# EAGLE schematic cluster (EAGLE 9.6.2)
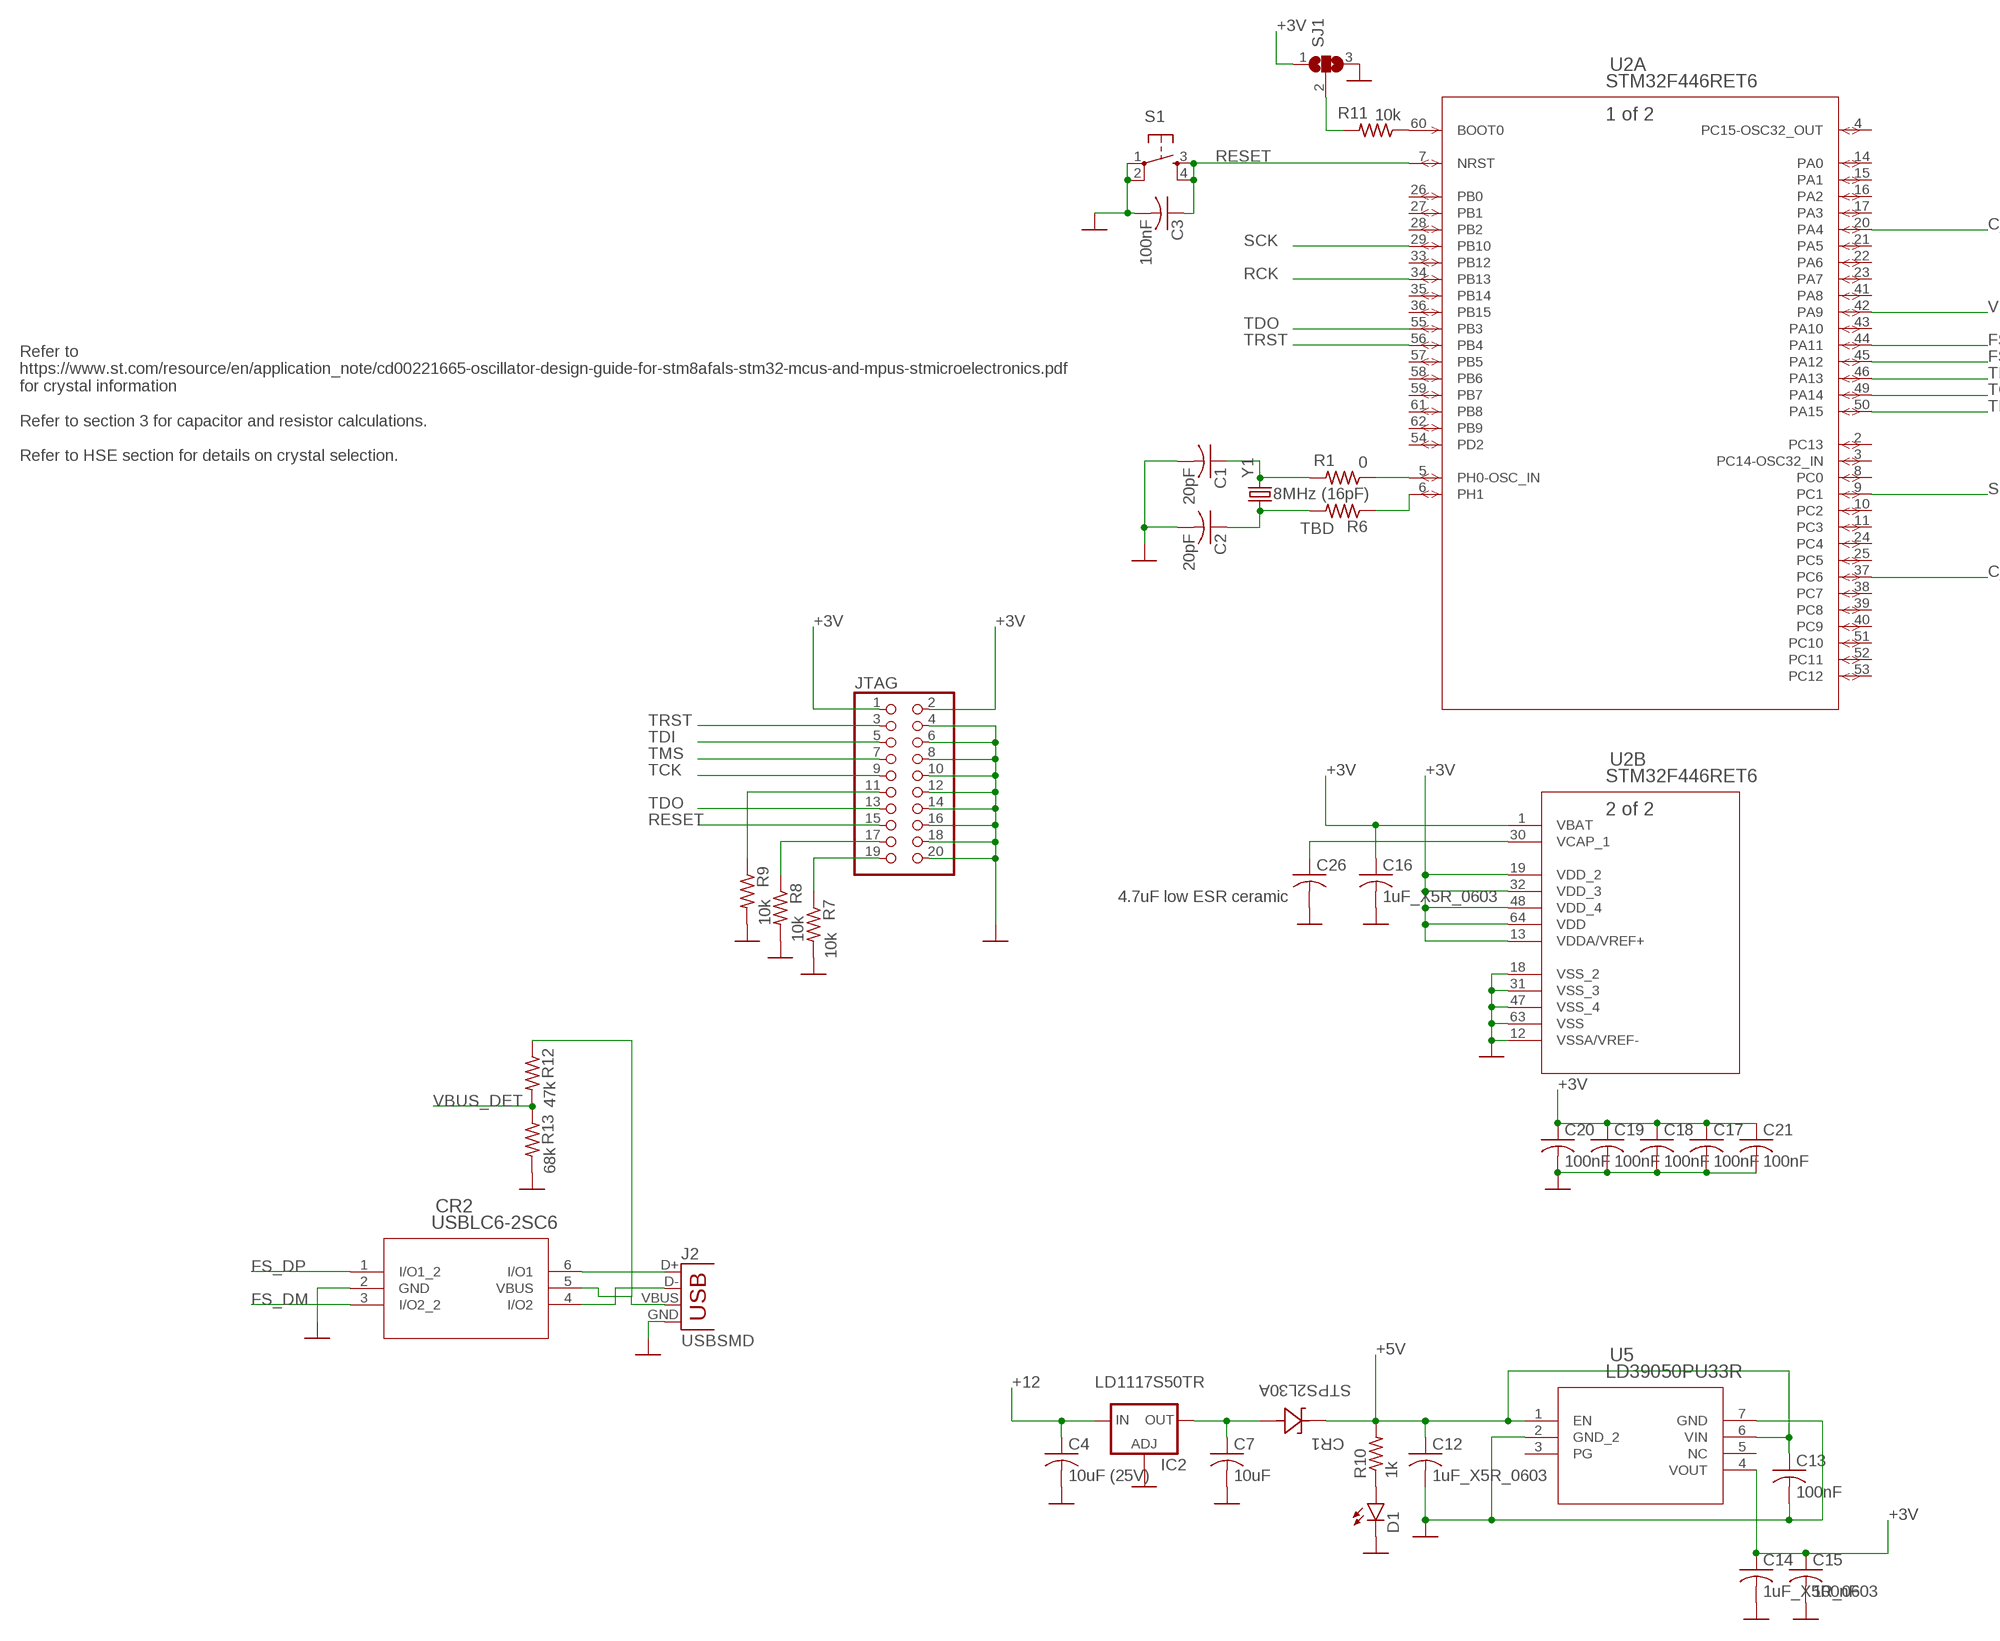
[diagram p0: schematic, sheet 1, part 1 of 2]
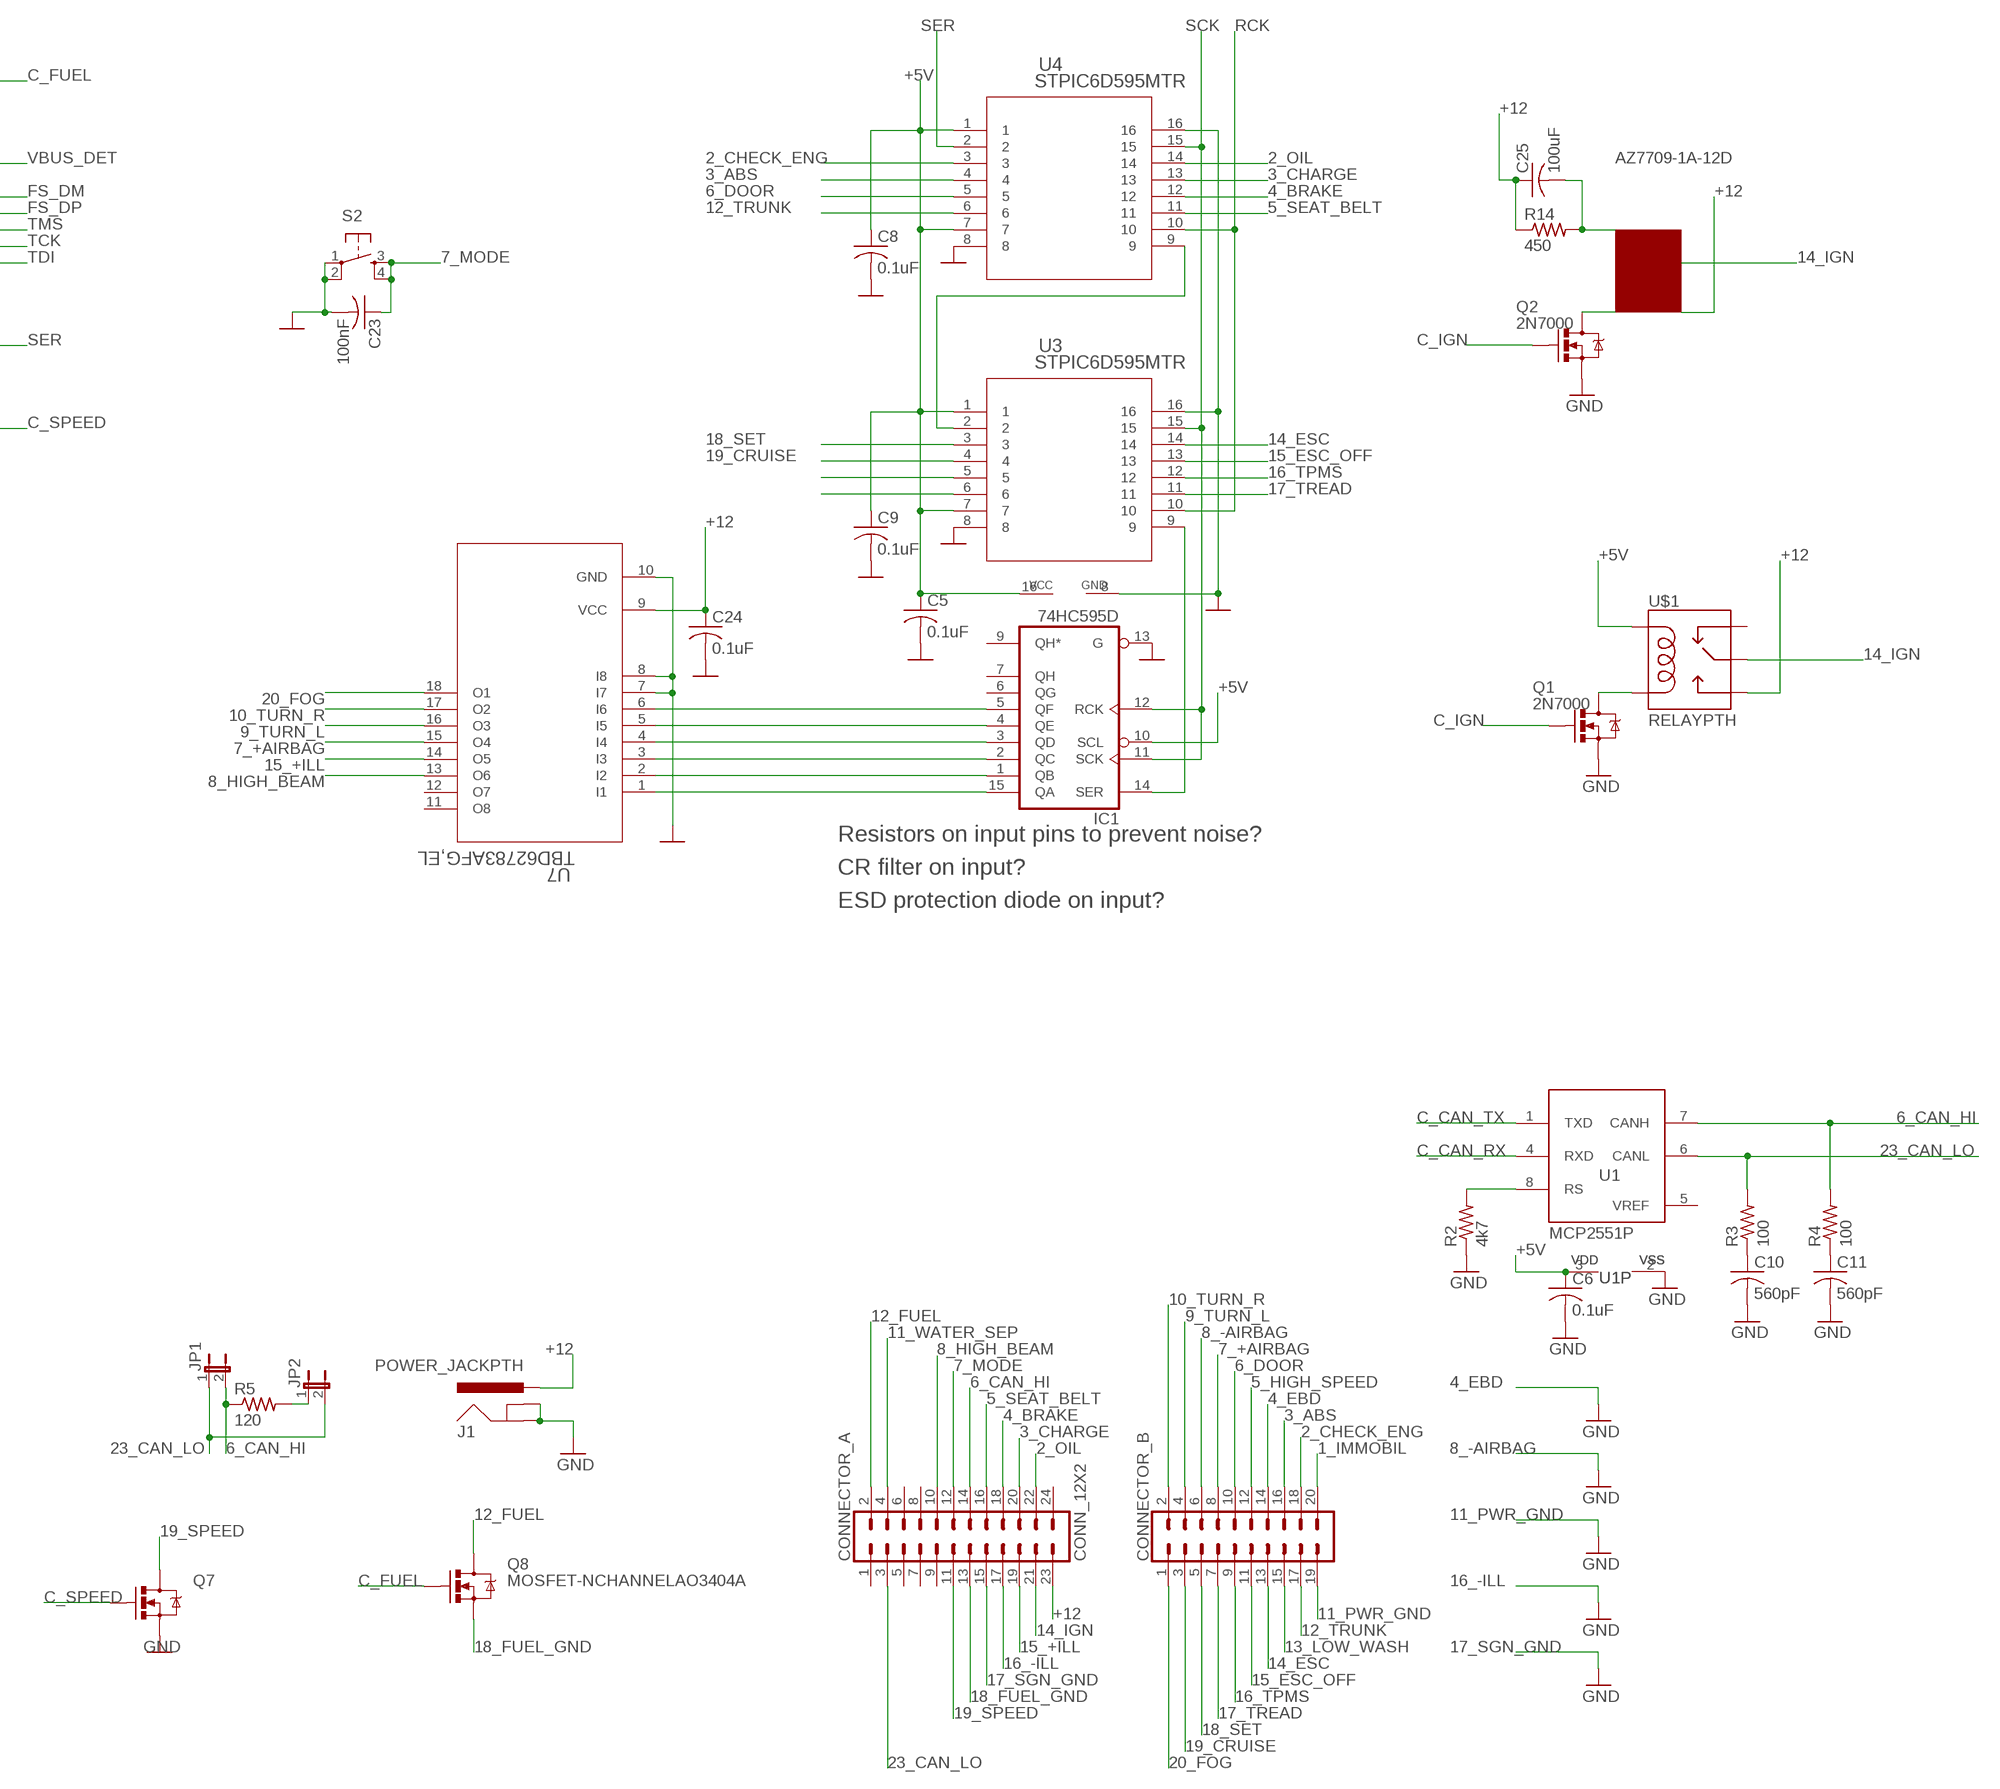
[diagram p1: schematic, sheet 1, part 2 of 2]

## Parts
C1  20pF  C-USC0805K  [C0805K]
C2  20pF  C-USC0805K  [C0805K]
C3  100nF  C-USC0805K  [C0805K]
C4  10uF (25V)  C-USC0805K  [C0805K]
C5  0.1uF  C-USC0805K  [C0805K]
C6  0.1uF  C-USC0805K  [C0805K]
C7  10uF  C-USC0805K  [C0805K]
C8  0.1uF  C-USC0805K  [C0805K]
C9  0.1uF  C-USC0805K  [C0805K]
C10  560pF  C-USC0805K  [C0805K]
C11  560pF  C-USC0805K  [C0805K]
C12  1uF_X5R_0603  C-USC0805K  [C0805K]
C13  100nF  C-USC0805K  [C0805K]
C14  1uF_X5R_0603  C-USC0805K  [C0805K]
C15  100nF  C-USC0805K  [C0805K]
C16  1uF_X5R_0603  C-USC0805K  [C0805K]
C17  100nF  C-USC0805K  [C0805K]
C18  100nF  C-USC0805K  [C0805K]
C19  100nF  C-USC0805K  [C0805K]
C20  100nF  C-USC0805K  [C0805K]
C21  100nF  C-USC0805K  [C0805K]
C23  100nF  C-USC0805K  [C0805K]
C24  0.1uF  C-USC0805K  [C0805K]
C25  100uF  C-USC0805K  [C0805K]
C26  4.7uF low ESR ceramic  C-USC1206K  [C1206K]
CONNECTOR_A  CONN_12X2  [2X12]
CONNECTOR_B  CONN_10X2NOSILK  [2X10_NOSILK]
CR1  STPS2L30A  [SMA_STM]
CR2  USBLC6-2SC6  [SOT23-6L_STM]
D1  LED-FKIT-1206  [FKIT-LED-1206]
IC1  74HC595D  [SO16]
IC2  LD117AS12TR  [SOT223]
J1  POWER_JACKPTH  [POWER_JACK_PTH]
J2  USBSMD  [USB-MINIB]
JP1  JP1E  [JP1]
JP2  JP1E  [JP1]
JTAG  PINHD-2X10  [2X10]
Q1  2N7000  MOSFET-NCHANNELAO3404A  [SOT23-3]
Q2  2N7000  MOSFET-NCHANNELAO3404A  [SOT23-3]
Q7  MOSFET-NCHANNELAO3404A  [SOT23-3]
Q8  MOSFET-NCHANNELAO3404A  [SOT23-3]
R1  0  R-US_R0805  [R0805]
R2  4k7  R-US_R0805  [R0805]
R3  100  R-US_R0805  [R0805]
R4  100  R-US_R0805  [R0805]
R5  120  R-US_R0805  [R0805]
R6  TBD  R-US_R0805  [R0805]
R7  10k  R-US_R0805  [R0805]
R8  10k  R-US_R0805  [R0805]
R9  10k  R-US_R0805  [R0805]
R10  1k  R-US_R0805  [R0805]
R11  10k  R-US_R0805  [R0805]
R12  47k  R-US_R0805  [R0805]
R13  68k  R-US_R0805  [R0805]
R14  450  R-US_R0805  [R0805]
S1  TAC_SWITCHPTH  [TACTILE-PTH]
S2  TAC_SWITCHPTH  [TACTILE-PTH]
SJ1  SJ2WW  [SJ_2W]
U1  MCP2551P  [DIL8]
U2  STM32F446RET6  [LQFP64-10X10MM]
U3  STPIC6D595MTR  [SO16_STPIC6D595MTR_STM]
U4  STPIC6D595MTR  [SO16_STPIC6D595MTR_STM]
U5  LD39050PU33R  [DFN6_3X3_STM]
U7  TBD62783AFG,EL  [SOP18-P-375-1P27_TOS]
U$1  RELAYPTH  [SRD-05VDC-SL-C]
Y1  8MHz (16pF)  CRYSTALHC49US  [HC49US]

## Nets
1_IMMOBIL: CONNECTOR_B.20
2_CHECK_ENG: CONNECTOR_B.18 U4.3
2_OIL: CONNECTOR_A.22 U4.14
3_ABS: CONNECTOR_B.16 U4.4
3_CHARGE: CONNECTOR_A.20 U4.13
4_BRAKE: CONNECTOR_A.18 U4.12
4_EBD: CONNECTOR_B.14 ; supply symbol labelled GND
5_HIGH_SPEED: CONNECTOR_B.12
5_SEAT_BELT: CONNECTOR_A.16 U4.11
6_CAN_HI: CONNECTOR_A.14 JP1.2 R4.2 R5.1 U1.7(CANH)
6_DOOR: CONNECTOR_B.10 U4.5
7_+AIRBAG: CONNECTOR_B.8 U7.15(O4)
7_MODE: C23.1 CONNECTOR_A.12 S2.3 S2.4
8_-AIRBAG: CONNECTOR_B.6 ; supply symbol labelled GND
8_HIGH_BEAM: CONNECTOR_A.10 U7.13(O6)
9_TURN_L: CONNECTOR_B.4 U7.16(O3)
10_TURN_R: CONNECTOR_B.2 U7.17(O2)
11_PWR_GND: CONNECTOR_B.19 ; supply symbol labelled GND
11_WATER_SEP: CONNECTOR_A.4
12_FUEL: CONNECTOR_A.2 Q8.3(D)
12_TRUNK: CONNECTOR_B.17 U4.6
13_LOW_WASH: CONNECTOR_B.15
14_ESC: CONNECTOR_B.13 U3.14
14_IGN: CONNECTOR_A.21 U$1.SWCOMMON
15_+ILL: CONNECTOR_A.19 U7.14(O5)
15_ESC_OFF: CONNECTOR_B.11 U3.13
16_-ILL: CONNECTOR_A.17 ; supply symbol labelled GND
16_TPMS: CONNECTOR_B.9 U3.12
17_SGN_GND: CONNECTOR_A.15 ; supply symbol labelled GND
17_TREAD: CONNECTOR_B.7 U3.11
18_FUEL_GND: CONNECTOR_A.13 Q8.2(S)
18_SET: CONNECTOR_B.5 U3.3
19_CRUISE: CONNECTOR_B.3 U3.4
19_SPEED: CONNECTOR_A.11 Q7.3(D)
20_FOG: CONNECTOR_B.1 U7.18(O1)
23_CAN_LO: CONNECTOR_A.3 JP1.1 JP2.2 R3.2 U1.6(CANL)
+3V: C14.1 C15.1 C16.1 C17.1 C18.1 C19.1 C20.1 C21.1 JTAG.1 JTAG.2 SJ1.1 U2.1(B:VBAT) U2.13(B:VDDA/VREF+) U2.19(B:VDD_2) U2.32(B:VDD_3) U2.48(B:VDD_4) U2.64(B:VDD) U5.4(VOUT)
+5V: C5.1 C6.1 C8.1 C9.1 C12.1 C13.1 CR1.2(A) IC1.10(SCL) IC1.16(VCC) R10.2 U1.3(VDD) U3.1 U3.7 U4.1 U4.7 U5.1(EN) U5.6(VIN) U$1.COIL1
+12: C4.1 C24.1 C25.1 CONNECTOR_A.23 IC2.3(IN) J1.PWR R14.1 U7.9(VCC) U$1.SWOPEN
C_CAN_RX: U1.4(RXD)
C_CAN_TX: U1.1(TXD)
C_FUEL: Q8.1(G) U2.20(A:PA4)
C_IGN: Q1.1(G) Q2.1(G)
C_SPEED: Q7.1(G) U2.37(A:PC6)
FS_DM: CR2.3(I/O2_2) U2.44(A:PA11)
FS_DP: CR2.1(I/O1_2) U2.45(A:PA12)
GND: C1.2 C2.2 C3.2 C4.2 C5.2 C6.2 C7.2 C8.2 C9.2 C10.2 C11.2 C12.2 C13.2 C14.2 C15.2 C16.2 C17.2 C18.2 C19.2 C20.2 C21.2 C23.2 C24.2 C26.2 CR2.2(GND) D1.C IC1.8(GND) IC1.13(G) IC2.1(ADJ) J1.GND J1.GNDBREAK J2.GND JTAG.4 JTAG.6 JTAG.8 JTAG.10 JTAG.12 JTAG.14 JTAG.16 JTAG.18 JTAG.20 Q1.2(S) Q2.2(S) Q7.2(S) R2.1 R7.2 R8.2 R9.2 R13.2 S1.1 S1.2 S2.1 S2.2 SJ1.3 U1.2(VSS) U2.12(B:VSSA/VREF-) U2.18(B:VSS_2) U2.31(B:VSS_3) U2.47(B:VSS_4) U2.63(B:VSS) U3.8 U3.16 U4.8 U4.16 U5.2(GND_2) U5.7(GND) U7.7(I7) U7.8(I8) U7.10(GND)
N$1: U3.2 U4.9
N$2: IC1.14(SER) U3.9
N$3: IC1.15(QA) U7.1(I1)
N$4: IC1.1(QB) U7.2(I2)
N$5: IC1.2(QC) U7.3(I3)
N$6: C7.1 CR1.1(K) IC2.4(OUT)
N$7: JP2.1 R5.2
N$8: R2.2 U1.8(RS)
N$9: IC1.3(QD) U7.4(I4)
N$10: IC1.4(QE) U7.5(I5)
N$11: C10.1 R3.1
N$12: C11.1 R4.1
N$13: IC1.5(QF) U7.6(I6)
N$14: U3.5
N$15: U3.6
N$16: R1.1 U2.5(A:PH0-OSC_IN)
N$17: R6.1 U2.6(A:PH1)
N$18: C1.1 R1.2 Y1.2
N$19: C2.1 R6.2 Y1.1
N$20: JTAG.19 R7.1
N$21: JTAG.17 R8.1
N$22: JTAG.11 R9.1
N$23: D1.A R10.1
N$24: C25.2 R14.2
N$25: C26.1 U2.30(B:VCAP_1)
N$27: R11.1 U2.60(A:BOOT0)
N$28: R11.2 SJ1.2
N$29: CR2.6(I/O1) J2.D+
N$30: CR2.4(I/O2) J2.D-
N$31: CR2.5(VBUS) J2.VBUS R12.1
N$33: Q1.3(D) U$1.COIL0
N$35: Q2.3(D)
RCK: U2.34(A:PB13) U3.10 U4.10
RESET: C3.1 JTAG.15 S1.3 S1.4 U2.7(A:NRST)
SCK: IC1.11(SCK) IC1.12(RCK) U2.29(A:PB10) U3.15 U4.15
SER: U2.9(A:PC1) U4.2
TCK: JTAG.9 U2.49(A:PA14)
TDI: JTAG.5 U2.50(A:PA15)
TDO: JTAG.13 U2.55(A:PB3)
TMS: JTAG.7 U2.46(A:PA13)
TRST: JTAG.3 U2.56(A:PB4)
VBUS_DET: R12.2 R13.1 U2.42(A:PA9)
Unconnected: CONNECTOR_A.1 CONNECTOR_A.5 CONNECTOR_A.6 CONNECTOR_A.7 CONNECTOR_A.8 CONNECTOR_A.9 CONNECTOR_A.24 IC1.6(QG) IC1.7(QH) IC1.9(QH*) U2.2(A:PC13) U2.3(A:PC14-OSC32_IN) U2.4(A:PC15-OSC32_OUT) U2.8(A:PC0) U2.10(A:PC2) U2.11(A:PC3) U2.14(A:PA0) U2.15(A:PA1) U2.16(A:PA2) U2.17(A:PA3) U2.21(A:PA5) U2.22(A:PA6) U2.23(A:PA7) U2.24(A:PC4) U2.25(A:PC5) U2.26(A:PB0) U2.27(A:PB1) U2.28(A:PB2) U2.33(A:PB12) U2.35(A:PB14) U2.36(A:PB15) U2.38(A:PC7) U2.39(A:PC8) U2.40(A:PC9) U2.41(A:PA8) U2.43(A:PA10) U2.51(A:PC10) U2.52(A:PC11) U2.53(A:PC12) U2.54(A:PD2) U2.57(A:PB5) U2.58(A:PB6) U2.59(A:PB7) U2.61(A:PB8) U2.62(A:PB9) U5.5(NC) U7.11(O8) U7.12(O7) U$1.SWCLOSED(SWCLOSE)

## Notes on the sheet
- AZ7709-1A-12D
- Refer to
  https://www.st.com/resource/en/application_note/cd00221665-oscillator-design-guide-for-stm8afals-stm32-mcus-and-mpus-stmicroelectronics.pdf
  for crystal information
  
  Refer to section 3 for capacitor and resistor calculations.
  
  Refer to HSE section for details on crystal selection.
- Resistors on input pins to prevent noise?
- CR filter on input?
- ESD protection diode on input?
- LD1117S50TR

## Power pins joined to a net without a drawn wire
PG: U5.3(PG)
VREF: U1.5(VREF)

## Library data of the parts
C1-C21 C23-C26 = rcl:C-US: CAPACITOR, American symbol; SPICEPREFIX: C
CONNECTOR_A = SparkFun-Connectors:CONN_12X2: Multi connection point. Often used as Generic Header-pin footprint for 0.1 inch spaced/style header connections On any of the 0.1 inch spaced packages, you can populate with these: Break Away Headers - Straight <https://www.sparkfun.com/products/116> (PRT-00116) Break Away Male Headers - Right Angle <https://www.sparkfun.com/products/553> (PRT-00553) Female Headers <https://www.sparkfun.com/products/115> (PRT-00115) Break Away Headers - Machine Pin <https://www.sparkfun.com/products/117> (PRT-00117) Break Away Female Headers - Swiss Machine Pin <https://www.sparkfun.com/products/743> (PRT-00743)
CONNECTOR_B = SparkFun-Connectors:CONN_10X2: Multi connection point. Often used as Generic Header-pin footprint for 0.1 inch spaced/style header connections On any of the 0.1 inch spaced packages, you can populate with these: Break Away Headers - Straight <https://www.sparkfun.com/products/116> (PRT-00116) Break Away Male Headers - Right Angle <https://www.sparkfun.com/products/553> (PRT-00553) Female Headers <https://www.sparkfun.com/products/115> (PRT-00115) Break Away Headers - Machine Pin <https://www.sparkfun.com/products/117> (PRT-00117) Break Away Female Headers - Swiss Machine Pin <https://www.sparkfun.com/products/743> (PRT-00743) Special note about the "SPECIAL" package: This was SPECIALLY designed to be used with our Graphic LCD Backpack. Be sure you want to use this! It is not only staggered on each line of header holes, but IT IS ALSO offset of the center point of the top and bottom lines by 5 mil. This causes the headers to lock into place on the "standard" footprint on the LCD screen. The extra squares on the tdocu layer are there simply to reference other pins (if you were to actually populate a longer header than ten long - this is what we do with the backpacks).
CR1 = STPS2L30A:STPS2L30A; BUILT_BY: EMA_UL_Team; MANUFACTURER_PART_NUMBER: STPS2L30A; SOURCELIBRARY: Update_to_database_2020-11-24; VENDOR: STMicroelectronics
CR2 = USBLC6:USBLC6-2SC6; BUILT_BY: EMA_UL_Team; MANUFACTURER_PART_NUMBER: USBLC6-2SC6; SOURCELIBRARY: Update_to_database_2020-12-04; VENDOR: STMicroelectronics
D1 = SparkFun-LED:LED: LEDs Standard schematic elements and footprints for 5mm, 3mm, 1206, and 0603 sized LEDs. 5mm - Spark Fun Electronics SKU : COM-00529 (and others)
IC1 = 74xx-eu:74*595: 8-bit SHIFT REGISTER, output latch
IC2 = v-reg:LD117A?*: Low drop fixed and adjustable positive voltage regulators 1 A Source: http://www.st.com/stonline/products/literature/ds/7194/ld1117axx.pdf
J1 = SparkFun-Connectors:POWER_JACK: Power Jack This is the standard 5.5mm barrel jack for power. The PTH is the most common, proven, reliable, footprint. The Slot footprint only works if the mill layer is transmitted to the PCB fab house so be warned. Mating wall wart : TOL-00298 (and others); PROD_ID: CONN-08197
J2 = SparkFun-Connectors:USB: USB Connectors USB-B-PTH is fully proven SKU : PRT-00139/CONN-08278 USB-miniB is fully proven SKU : PRT-00587 USB-A-PCB is untested. USB-A-H is throughly reviewed, but untested. Spark Fun Electronics SKU : PRT-00437 USB-B-SMT is throughly reviewed, but untested. Needs silkscreen touching up. USB-A-S has not been used/tested USB-MB-H has not been used/tested USB-MICROB has been used. CONN-09505; PROD_ID: CONN-08193
JP1 JP2 = jumper:JP1E: JUMPER
JTAG = pinhead:PINHD-2X10: PIN HEADER
Q1 Q2 Q7 Q8 = SparkFun-DiscreteSemi:MOSFET-NCHANNEL: Common NMOSFET Parts MFG P/N Store ID Prod ID FDD8780 TRANS-09984 SI7820DN TRANS-11055 FDS6630A IC-08089 2N7002PW TRANS-11151 FQP30N06L COM-10213 TRANS-10060 BSS123LT1G TRANS-08345 BSS138 TRANS-00830 BS170 2N7000; PROD_ID: TRAN-12988
R1-R14 = rcl:R-US_: RESISTOR, American symbol; SPICEPREFIX: R
S1 S2 = SparkFun-Retired:TAC_SWITCH: Momentary Switch Button commonly used for reset or general input. Spark Fun Electronics SKU : COM-00097 SMT- SWCH-08247
SJ1 = jumper:SJ2W: SMD solder JUMPER
U1 = microchip_can:MCP2551: High Speed CAN tranceiver
U2 = stm32f446ret6:STM32F446RET6; BUILT_BY: EMA_UL_Team; COPYRIGHT: Copyright (C) 2018 Accelerated Designs. All rights reserved; MANUFACTURER_PART_NUMBER: STM32F446RET6; SOURCELIBRARY: Updates_to_database_2020-10-19; VENDOR: STMicroelectronics
U3 U4 = STPIC6D595:STPIC6D595MTR; BUILT_BY: EMA_Kyle; COPYRIGHT: Copyright (C) 2018 Accelerated Designs. All rights reserved; DATASHEET: https://www.st.com/resource/en/datasheet/stpic6d595.pdf; MANUFACTURER_PART_NUMBER: STPIC6D595MTR; SOURCELIBRARY: Add_to_database_2020-10-27; VENDOR: STMicroelectronics
U5 = LD39050PU33R:LD39050PU33R; BUILT_BY: EMA_Jessica; COPYRIGHT: Copyright (C) 2018 Accelerated Designs. All rights reserved; MANUFACTURER_PART_NUMBER: LD39050PU33R; SOURCELIBRARY: Updates_to_database_2020-11-13; VENDOR: STMicroelectronics
U7 = TBD62783AFG:TBD62783AFG,EL; BUILT_BY: EMA_Justin; COPYRIGHT: Copyright (C) 2018 Accelerated Designs. All rights reserved; MANUFACTURER_PART_NUMBER: TBD62783AFG,EL; SOURCELIBRARY: Add_to_database_2021-01-18; VENDOR: Toshiba
U$1 = SRD-05VDC-SL-C:RELAY: SPDT relay (COM-00101)
Y1 = SparkFun-FreqCtrl:CRYSTAL: Various standard crystals. Proven footprints.